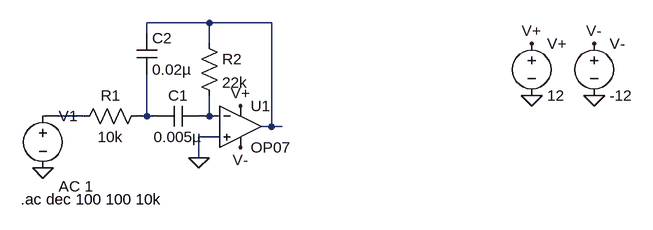
[diagram p0: schematic exp43.asc]
exp43.asc, the LTspice schematic file:
Version 4
SHEET 1 880 680
WIRE 208 -64 112 -64
WIRE 304 -64 208 -64
WIRE 112 -48 112 -64
WIRE 208 -32 208 -64
WIRE 16 80 -48 80
WIRE 112 80 112 16
WIRE 112 80 96 80
WIRE 128 80 112 80
WIRE 208 80 208 48
WIRE 208 80 192 80
WIRE 224 80 208 80
WIRE 304 96 304 -64
WIRE 304 96 288 96
WIRE 320 96 304 96
WIRE 224 112 192 112
WIRE 192 144 192 112
FLAG 704 48 0
FLAG 800 48 0
FLAG 192 144 0
FLAG 704 -32 V+
FLAG 256 64 V+
FLAG 800 -32 V-
FLAG 256 128 V-
FLAG -48 160 0
SYMBOL voltage -48 64 R0
WINDOW 123 24 124 Left 2
WINDOW 39 0 0 Left 0
SYMATTR InstName V1
SYMATTR Value ""
SYMATTR Value2 AC 1
SYMBOL voltage 704 -48 R0
WINDOW 123 0 0 Left 0
WINDOW 39 0 0 Left 0
SYMATTR InstName V+
SYMATTR Value 12
SYMBOL voltage 800 -48 R0
WINDOW 123 0 0 Left 0
WINDOW 39 0 0 Left 0
SYMATTR InstName V-
SYMATTR Value -12
SYMBOL OpAmps\\OP07 256 32 R0
SYMATTR InstName U1
SYMBOL res 112 64 R90
WINDOW 0 0 56 VBottom 2
WINDOW 3 32 56 VTop 2
SYMATTR InstName R1
SYMATTR Value 10k
SYMBOL cap 192 64 R90
WINDOW 0 0 32 VBottom 2
WINDOW 3 32 32 VTop 2
SYMATTR InstName C1
SYMATTR Value 0.005µ
SYMBOL cap 96 -48 R0
SYMATTR InstName C2
SYMATTR Value 0.02µ
SYMBOL res 192 -48 R0
SYMATTR InstName R2
SYMATTR Value 22k
TEXT -82 208 Left 2 !.ac dec 100 100 10k

The netlist it stands for:
* exp43.asc
V1 N002 0 AC 1
V+ V+ 0 12
V- V- 0 -12
XU1 0 N004 V+ V- N001 LT1001  ; OP07, pins In+ In- V+ V- OUT
R1 N003 N002 10k
C1 N004 N003 0.005µ
C2 N001 N003 0.02µ
R2 N001 N004 22k
.ac dec 100 100 10k
.lib LTC.lib
.backanno
.end